# Altium schematic sheet esp32_dht11.SchDoc
size A4; SheetNumber: 1; SheetTotal: 5
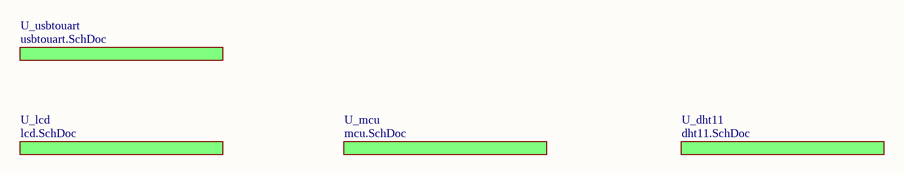
[diagram p0: esp32_dht11.SchDoc]

## Sub-sheets
U_dht11 = dht11.SchDoc: no entries
U_lcd = lcd.SchDoc: no entries
U_mcu = mcu.SchDoc: no entries
U_usbtouart = usbtouart.SchDoc: no entries